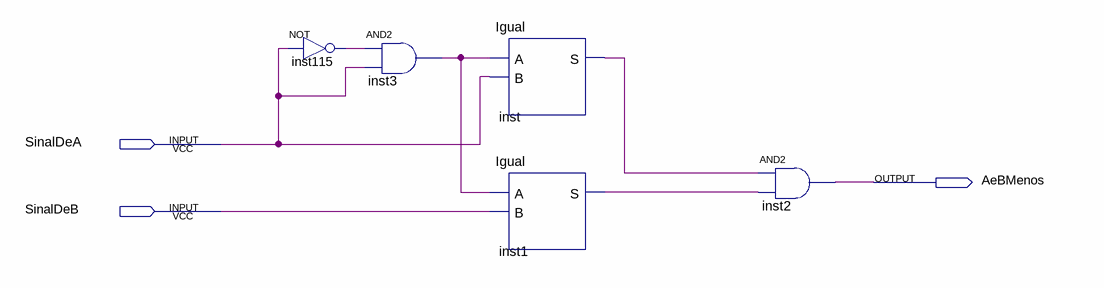
[diagram p0: schematic sheet]
// Quartus schematic AeBMenos.bdf as structural Verilog: 5 symbols, 3 pins
module AeBMenos (
  input  SinalDeA,
  input  SinalDeB,
  output AeBMenos
);

  wire inst1_s, inst3_out, inst115_out, inst_s;

  not inst115 (inst115_out, SinalDeA);
  and inst3 (inst3_out, inst115_out, SinalDeA);
  Igual inst (.A(inst3_out), .B(SinalDeA), .S(inst_s));
  Igual inst1 (.A(inst3_out), .B(SinalDeB), .S(inst1_s));
  and inst2 (AeBMenos, inst_s, inst1_s);
endmodule
